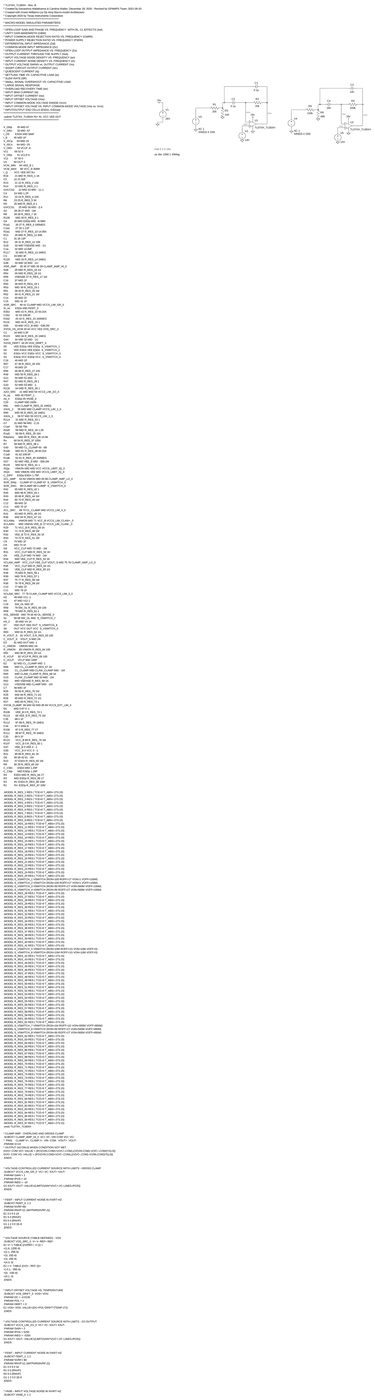
[diagram p0: schematic bandpass.asc, whole sheet]
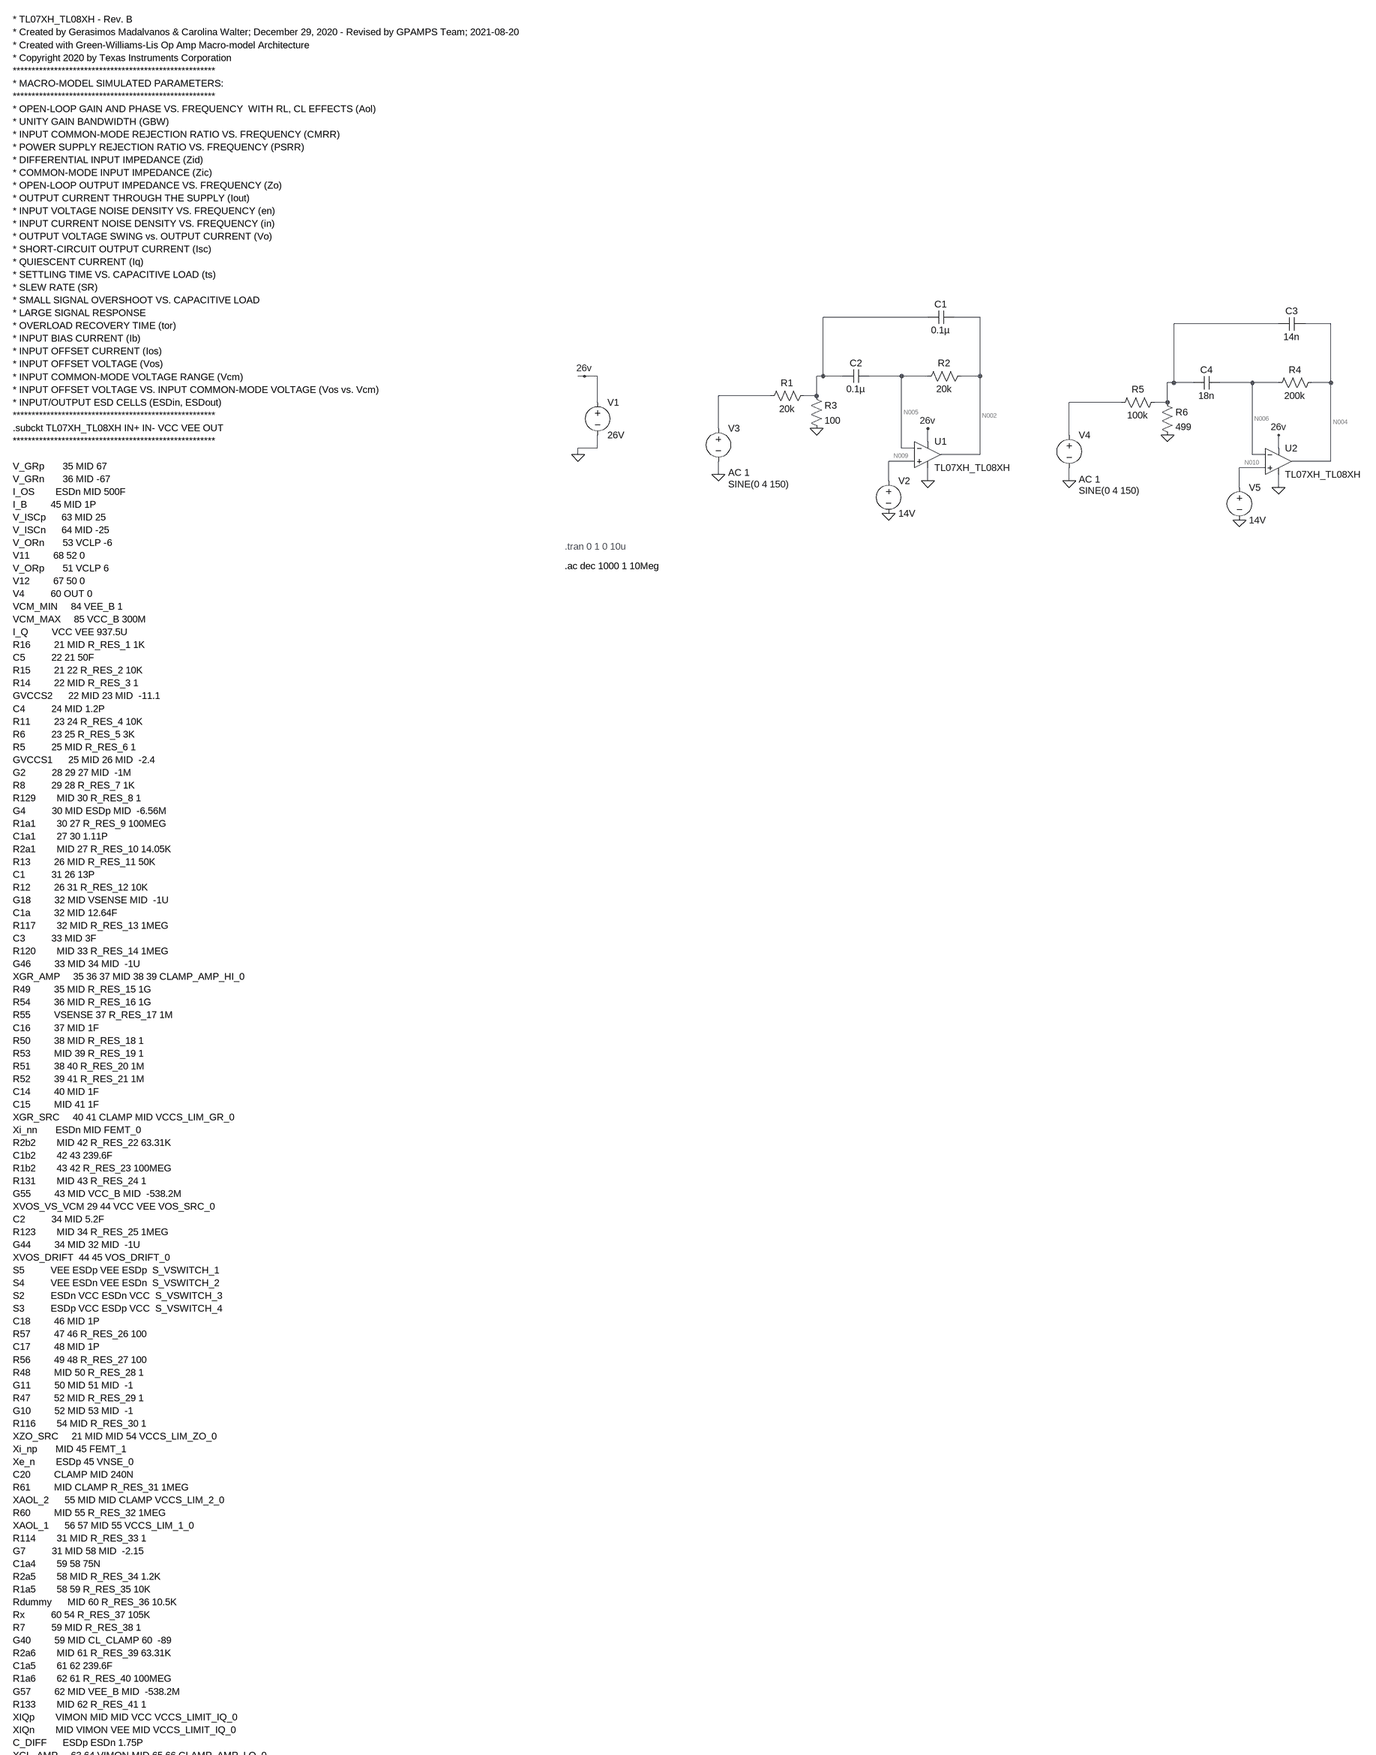
[diagram p1: schematic bandpass.asc, part, row 1 of 3, column 1 of 1]
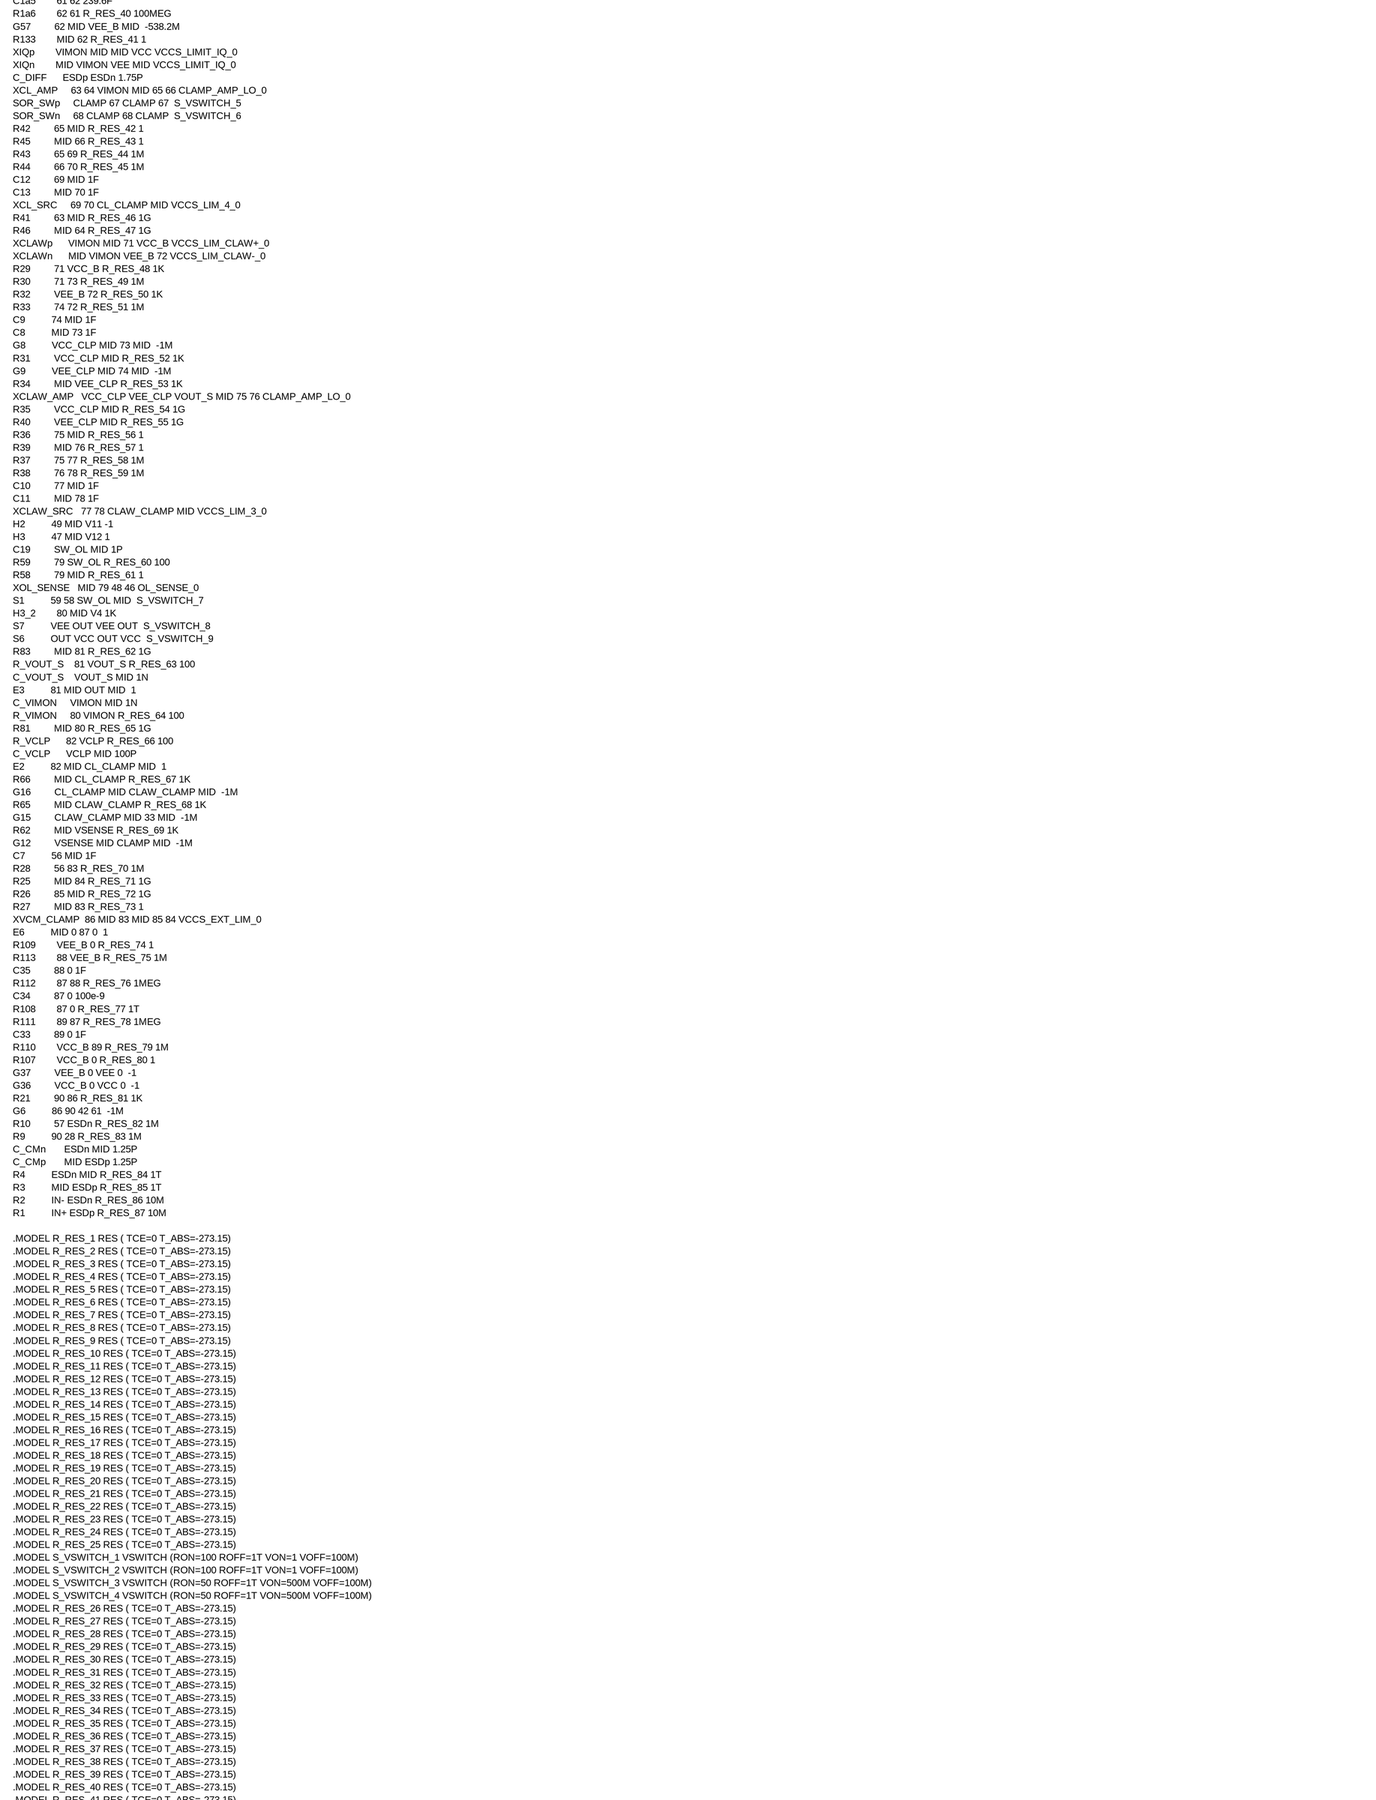
[diagram p2: schematic bandpass.asc, part, row 2 of 3, column 1 of 1]
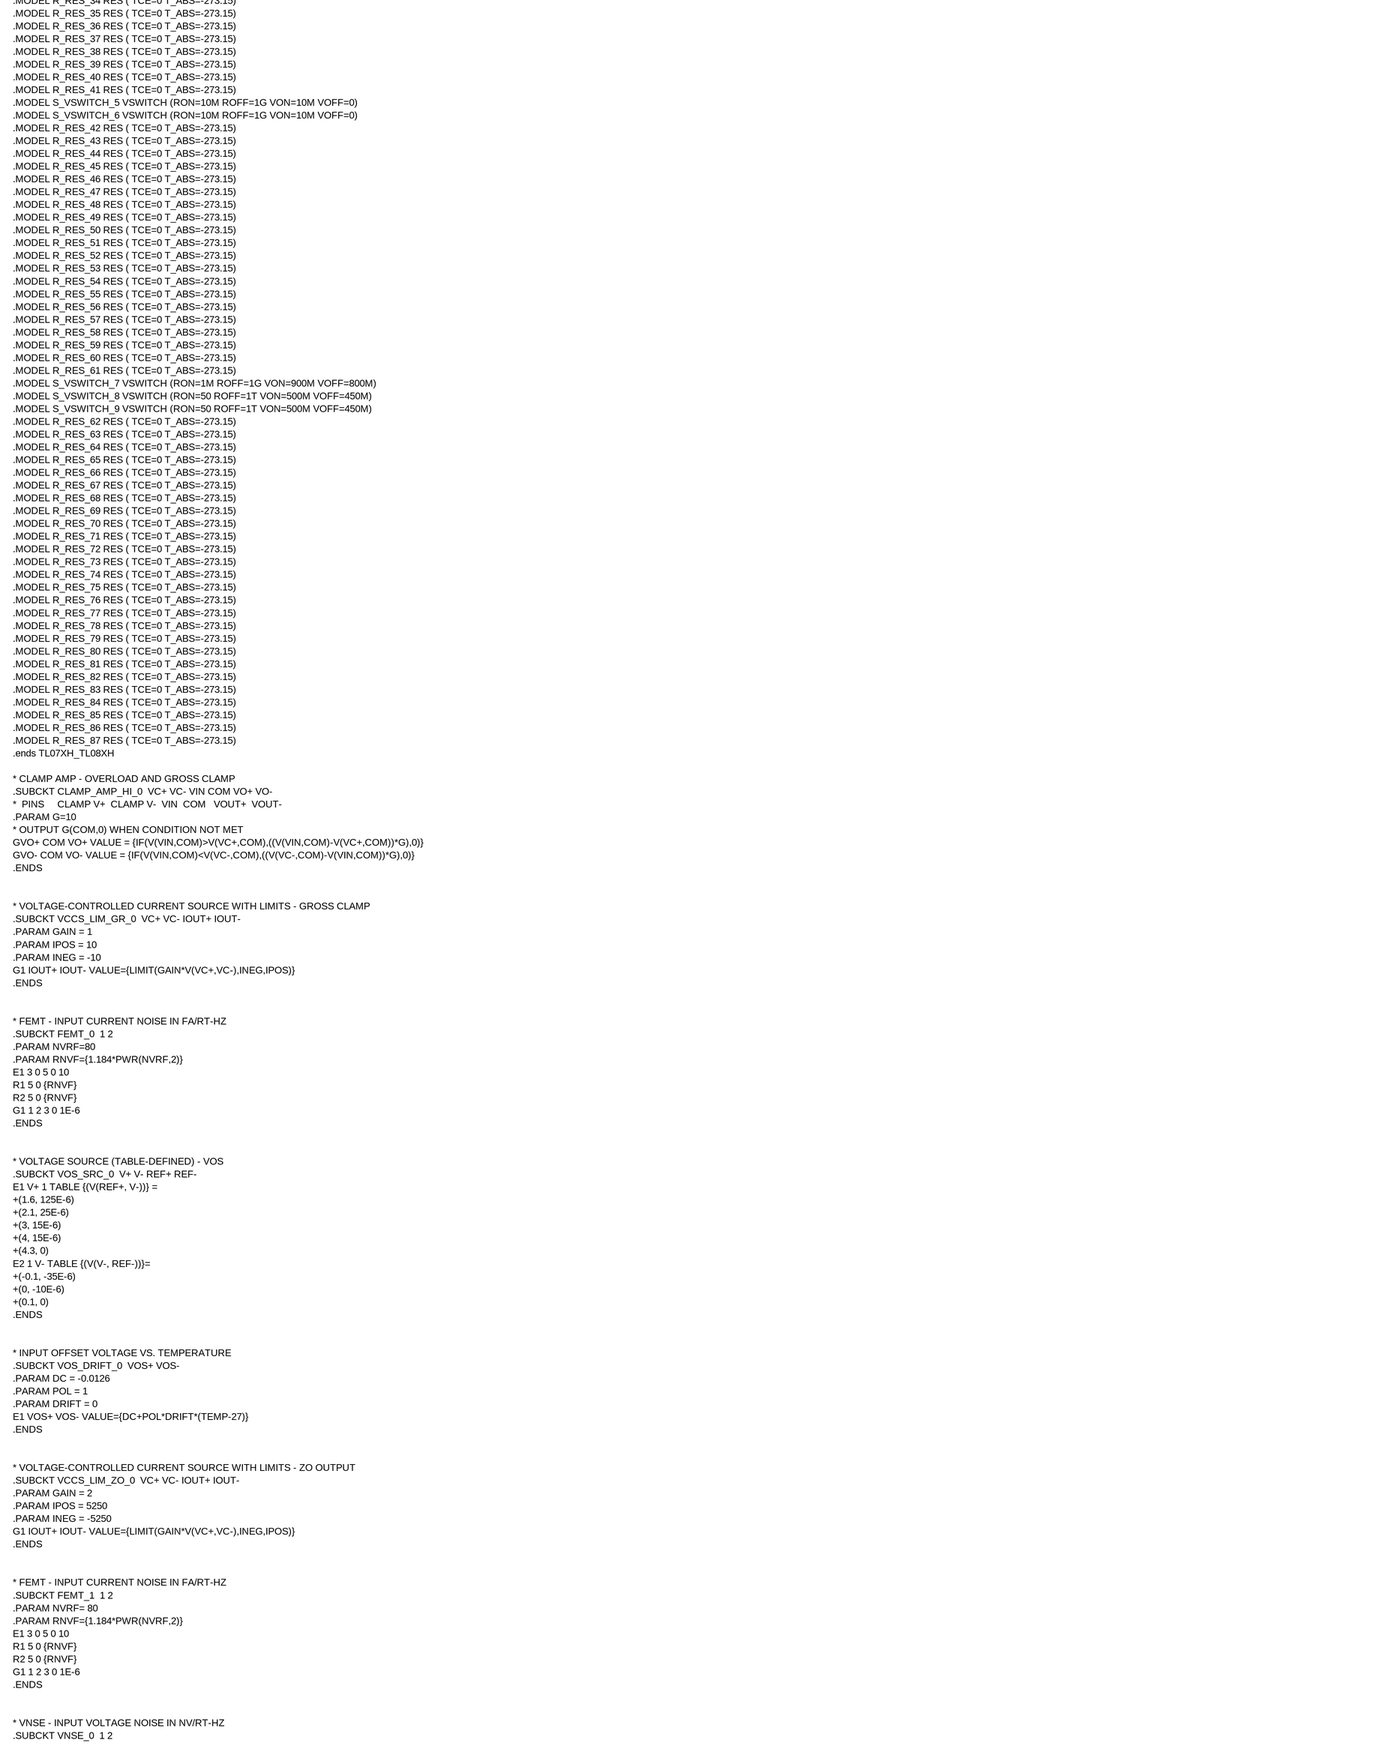
[diagram p3: schematic bandpass.asc, part, row 3 of 3, column 1 of 1]
bandpass.asc, the LTspice schematic file:
Version 4
SHEET 1 1752 12944
WIRE 640 -288 384 -288
WIRE 768 -288 704 -288
WIRE 1536 -272 1280 -272
WIRE 1664 -272 1600 -272
WIRE -720 -144 -736 -144
WIRE -688 -144 -720 -144
WIRE 384 -144 384 -288
WIRE 384 -144 368 -144
WIRE 432 -144 384 -144
WIRE 576 -144 496 -144
WIRE 640 -144 576 -144
WIRE 768 -144 768 -288
WIRE 768 -144 720 -144
WIRE 1280 -128 1280 -272
WIRE 1280 -128 1264 -128
WIRE 1328 -128 1280 -128
WIRE 1472 -128 1392 -128
WIRE 1536 -128 1472 -128
WIRE 1664 -128 1664 -272
WIRE 1664 -128 1616 -128
WIRE 256 -96 128 -96
WIRE 368 -96 368 -144
WIRE 368 -96 336 -96
WIRE -688 -80 -688 -144
WIRE 1152 -80 1024 -80
WIRE 1264 -80 1264 -128
WIRE 1264 -80 1232 -80
WIRE 128 -16 128 -96
WIRE 1024 0 1024 -80
WIRE 640 16 640 -16
WIRE -688 32 -688 0
WIRE -688 32 -736 32
WIRE 576 32 576 -144
WIRE 608 32 576 32
WIRE 1536 32 1536 0
WIRE -736 48 -736 32
WIRE 768 48 768 -144
WIRE 768 48 672 48
WIRE 1472 48 1472 -128
WIRE 1504 48 1472 48
WIRE 608 64 544 64
WIRE 1664 64 1664 -128
WIRE 1664 64 1568 64
WIRE 1504 80 1440 80
WIRE 128 96 128 64
WIRE 544 112 544 64
WIRE 640 112 640 80
WIRE 1024 112 1024 80
WIRE 1440 128 1440 80
WIRE 1536 128 1536 96
FLAG -736 48 0
FLAG -720 -144 26v
FLAG 640 -16 26v
FLAG 128 96 0
FLAG 368 -16 0
FLAG 640 112 0
FLAG 544 192 0
FLAG 1536 0 26v
FLAG 1024 112 0
FLAG 1264 0 0
FLAG 1536 128 0
FLAG 1440 208 0
SYMBOL voltage -688 -96 R0
WINDOW 123 0 0 Left 0
WINDOW 39 0 0 Left 0
SYMATTR InstName V1
SYMATTR Value 26V
SYMBOL voltage 128 -32 R0
WINDOW 3 24 152 Left 2
WINDOW 123 24 124 Left 2
WINDOW 39 0 0 Left 0
SYMATTR Value SINE(0 4 150)
SYMATTR Value2 AC 1
SYMATTR InstName V3
SYMBOL res 736 -160 R90
WINDOW 0 0 56 VBottom 2
WINDOW 3 32 56 VTop 2
SYMATTR InstName R2
SYMATTR Value 20k
SYMBOL res 352 -112 R90
WINDOW 0 0 56 VBottom 2
WINDOW 3 32 56 VTop 2
SYMATTR InstName R1
SYMATTR Value 20k
SYMBOL res 352 -112 R0
SYMATTR InstName R3
SYMATTR Value 100
SYMBOL OpAmps\\opamp2 640 -16 R0
SYMATTR InstName U1
SYMATTR Value TL07XH_TL08XH
SYMBOL voltage 544 96 R0
WINDOW 123 0 0 Left 0
WINDOW 39 0 0 Left 0
SYMATTR InstName V2
SYMATTR Value 14V
SYMBOL cap 704 -304 R90
WINDOW 0 0 32 VBottom 2
WINDOW 3 32 32 VTop 2
SYMATTR InstName C1
SYMATTR Value 0.1µ
SYMBOL cap 496 -160 R90
WINDOW 0 0 32 VBottom 2
WINDOW 3 32 32 VTop 2
SYMATTR InstName C2
SYMATTR Value 0.1µ
SYMBOL voltage 1024 -16 R0
WINDOW 3 24 152 Left 2
WINDOW 123 24 124 Left 2
WINDOW 39 0 0 Left 0
SYMATTR Value SINE(0 4 150)
SYMATTR Value2 AC 1
SYMATTR InstName V4
SYMBOL res 1632 -144 R90
WINDOW 0 0 56 VBottom 2
WINDOW 3 32 56 VTop 2
SYMATTR InstName R4
SYMATTR Value 200k
SYMBOL res 1248 -96 R90
WINDOW 0 0 56 VBottom 2
WINDOW 3 32 56 VTop 2
SYMATTR InstName R5
SYMATTR Value 100k
SYMBOL res 1248 -96 R0
SYMATTR InstName R6
SYMATTR Value 499
SYMBOL OpAmps\\opamp2 1536 0 R0
SYMATTR InstName U2
SYMATTR Value TL07XH_TL08XH
SYMBOL voltage 1440 112 R0
WINDOW 123 0 0 Left 0
WINDOW 39 0 0 Left 0
SYMATTR InstName V5
SYMATTR Value 14V
SYMBOL cap 1600 -288 R90
WINDOW 0 0 32 VBottom 2
WINDOW 3 32 32 VTop 2
SYMATTR InstName C3
SYMATTR Value 14n
SYMBOL cap 1392 -144 R90
WINDOW 0 0 32 VBottom 2
WINDOW 3 32 32 VTop 2
SYMATTR InstName C4
SYMATTR Value 18n
TEXT -768 272 Left 2 ;.tran 0 1 0 10u
TEXT -768 320 Left 2 !.ac dec 1000 1 10Meg
TEXT -2480 -1016 Left 2 !* TL07XH_TL08XH - Rev. B\n* Created by Gerasimos Madalvanos & Carolina Walter; December 29, 2020 - Revised by GPAMPS Team; 2021-08-20\n* Created with Green-Williams-Lis Op Amp Macro-model Architecture\n* Copyright 2020 by Texas Instruments Corporation\n******************************************************\n* MACRO-MODEL SIMULATED PARAMETERS:\n******************************************************\n* OPEN-LOOP GAIN AND PHASE VS. FREQUENCY  WITH RL, CL EFFECTS (Aol)\n* UNITY GAIN BANDWIDTH (GBW)\n* INPUT COMMON-MODE REJECTION RATIO VS. FREQUENCY (CMRR)\n* POWER SUPPLY REJECTION RATIO VS. FREQUENCY (PSRR)\n* DIFFERENTIAL INPUT IMPEDANCE (Zid)\n* COMMON-MODE INPUT IMPEDANCE (Zic)\n* OPEN-LOOP OUTPUT IMPEDANCE VS. FREQUENCY (Zo)\n* OUTPUT CURRENT THROUGH THE SUPPLY (Iout)\n* INPUT VOLTAGE NOISE DENSITY VS. FREQUENCY (en)\n* INPUT CURRENT NOISE DENSITY VS. FREQUENCY (in)\n* OUTPUT VOLTAGE SWING vs. OUTPUT CURRENT (Vo)\n* SHORT-CIRCUIT OUTPUT CURRENT (Isc)\n* QUIESCENT CURRENT (Iq)\n* SETTLING TIME VS. CAPACITIVE LOAD (ts)\n* SLEW RATE (SR)\n* SMALL SIGNAL OVERSHOOT VS. CAPACITIVE LOAD\n* LARGE SIGNAL RESPONSE\n* OVERLOAD RECOVERY TIME (tor)\n* INPUT BIAS CURRENT (Ib)\n* INPUT OFFSET CURRENT (Ios)\n* INPUT OFFSET VOLTAGE (Vos)\n* INPUT COMMON-MODE VOLTAGE RANGE (Vcm)\n* INPUT OFFSET VOLTAGE VS. INPUT COMMON-MODE VOLTAGE (Vos vs. Vcm)\n* INPUT/OUTPUT ESD CELLS (ESDin, ESDout)\n******************************************************\n.subckt TL07XH_TL08XH IN+ IN- VCC VEE OUT\n******************************************************\n \nV_GRp       35 MID 67\nV_GRn       36 MID -67\nI_OS        ESDn MID 500F\nI_B         45 MID 1P\nV_ISCp      63 MID 25\nV_ISCn      64 MID -25\nV_ORn       53 VCLP -6\nV11         68 52 0\nV_ORp       51 VCLP 6\nV12         67 50 0\nV4          60 OUT 0\nVCM_MIN     84 VEE_B 1\nVCM_MAX     85 VCC_B 300M\nI_Q         VCC VEE 937.5U\nR16         21 MID R_RES_1 1K \nC5          22 21 50F \nR15         21 22 R_RES_2 10K \nR14         22 MID R_RES_3 1 \nGVCCS2      22 MID 23 MID  -11.1\nC4          24 MID 1.2P \nR11         23 24 R_RES_4 10K \nR6          23 25 R_RES_5 3K \nR5          25 MID R_RES_6 1 \nGVCCS1      25 MID 26 MID  -2.4\nG2          28 29 27 MID  -1M\nR8          29 28 R_RES_7 1K \nR129        MID 30 R_RES_8 1 \nG4          30 MID ESDp MID  -6.56M\nR1a1        30 27 R_RES_9 100MEG \nC1a1        27 30 1.11P \nR2a1        MID 27 R_RES_10 14.05K \nR13         26 MID R_RES_11 50K \nC1          31 26 13P \nR12         26 31 R_RES_12 10K \nG18         32 MID VSENSE MID  -1U\nC1a         32 MID 12.64F \nR117        32 MID R_RES_13 1MEG \nC3          33 MID 3F \nR120        MID 33 R_RES_14 1MEG \nG46         33 MID 34 MID  -1U\nXGR_AMP     35 36 37 MID 38 39 CLAMP_AMP_HI_0\nR49         35 MID R_RES_15 1G \nR54         36 MID R_RES_16 1G \nR55         VSENSE 37 R_RES_17 1M \nC16         37 MID 1F \nR50         38 MID R_RES_18 1 \nR53         MID 39 R_RES_19 1 \nR51         38 40 R_RES_20 1M \nR52         39 41 R_RES_21 1M \nC14         40 MID 1F \nC15         MID 41 1F \nXGR_SRC     40 41 CLAMP MID VCCS_LIM_GR_0\nXi_nn       ESDn MID FEMT_0\nR2b2        MID 42 R_RES_22 63.31K \nC1b2        42 43 239.6F \nR1b2        43 42 R_RES_23 100MEG \nR131        MID 43 R_RES_24 1 \nG55         43 MID VCC_B MID  -538.2M\nXVOS_VS_VCM 29 44 VCC VEE VOS_SRC_0\nC2          34 MID 5.2F \nR123        MID 34 R_RES_25 1MEG \nG44         34 MID 32 MID  -1U\nXVOS_DRIFT  44 45 VOS_DRIFT_0\nS5          VEE ESDp VEE ESDp  S_VSWITCH_1\nS4          VEE ESDn VEE ESDn  S_VSWITCH_2\nS2          ESDn VCC ESDn VCC  S_VSWITCH_3\nS3          ESDp VCC ESDp VCC  S_VSWITCH_4\nC18         46 MID 1P \nR57         47 46 R_RES_26 100 \nC17         48 MID 1P \nR56         49 48 R_RES_27 100 \nR48         MID 50 R_RES_28 1 \nG11         50 MID 51 MID  -1\nR47         52 MID R_RES_29 1 \nG10         52 MID 53 MID  -1\nR116        54 MID R_RES_30 1 \nXZO_SRC     21 MID MID 54 VCCS_LIM_ZO_0\nXi_np       MID 45 FEMT_1\nXe_n        ESDp 45 VNSE_0\nC20         CLAMP MID 240N \nR61         MID CLAMP R_RES_31 1MEG \nXAOL_2      55 MID MID CLAMP VCCS_LIM_2_0\nR60         MID 55 R_RES_32 1MEG \nXAOL_1      56 57 MID 55 VCCS_LIM_1_0\nR114        31 MID R_RES_33 1 \nG7          31 MID 58 MID  -2.15\nC1a4        59 58 75N \nR2a5        58 MID R_RES_34 1.2K \nR1a5        58 59 R_RES_35 10K \nRdummy      MID 60 R_RES_36 10.5K \nRx          60 54 R_RES_37 105K \nR7          59 MID R_RES_38 1 \nG40         59 MID CL_CLAMP 60  -89\nR2a6        MID 61 R_RES_39 63.31K \nC1a5        61 62 239.6F \nR1a6        62 61 R_RES_40 100MEG \nG57         62 MID VEE_B MID  -538.2M\nR133        MID 62 R_RES_41 1 \nXIQp        VIMON MID MID VCC VCCS_LIMIT_IQ_0\nXIQn        MID VIMON VEE MID VCCS_LIMIT_IQ_0\nC_DIFF      ESDp ESDn 1.75P \nXCL_AMP     63 64 VIMON MID 65 66 CLAMP_AMP_LO_0\nSOR_SWp     CLAMP 67 CLAMP 67  S_VSWITCH_5\nSOR_SWn     68 CLAMP 68 CLAMP  S_VSWITCH_6\nR42         65 MID R_RES_42 1 \nR45         MID 66 R_RES_43 1 \nR43         65 69 R_RES_44 1M \nR44         66 70 R_RES_45 1M \nC12         69 MID 1F \nC13         MID 70 1F \nXCL_SRC     69 70 CL_CLAMP MID VCCS_LIM_4_0\nR41         63 MID R_RES_46 1G \nR46         MID 64 R_RES_47 1G \nXCLAWp      VIMON MID 71 VCC_B VCCS_LIM_CLAW+_0\nXCLAWn      MID VIMON VEE_B 72 VCCS_LIM_CLAW-_0\nR29         71 VCC_B R_RES_48 1K \nR30         71 73 R_RES_49 1M \nR32         VEE_B 72 R_RES_50 1K \nR33         74 72 R_RES_51 1M \nC9          74 MID 1F \nC8          MID 73 1F \nG8          VCC_CLP MID 73 MID  -1M\nR31         VCC_CLP MID R_RES_52 1K \nG9          VEE_CLP MID 74 MID  -1M\nR34         MID VEE_CLP R_RES_53 1K \nXCLAW_AMP   VCC_CLP VEE_CLP VOUT_S MID 75 76 CLAMP_AMP_LO_0\nR35         VCC_CLP MID R_RES_54 1G \nR40         VEE_CLP MID R_RES_55 1G \nR36         75 MID R_RES_56 1 \nR39         MID 76 R_RES_57 1 \nR37         75 77 R_RES_58 1M \nR38         76 78 R_RES_59 1M \nC10         77 MID 1F \nC11         MID 78 1F \nXCLAW_SRC   77 78 CLAW_CLAMP MID VCCS_LIM_3_0\nH2          49 MID V11 -1\nH3          47 MID V12 1\nC19         SW_OL MID 1P \nR59         79 SW_OL R_RES_60 100 \nR58         79 MID R_RES_61 1 \nXOL_SENSE   MID 79 48 46 OL_SENSE_0\nS1          59 58 SW_OL MID  S_VSWITCH_7\nH3_2        80 MID V4 1K\nS7          VEE OUT VEE OUT  S_VSWITCH_8\nS6          OUT VCC OUT VCC  S_VSWITCH_9\nR83         MID 81 R_RES_62 1G \nR_VOUT_S    81 VOUT_S R_RES_63 100 \nC_VOUT_S    VOUT_S MID 1N \nE3          81 MID OUT MID  1\nC_VIMON     VIMON MID 1N \nR_VIMON     80 VIMON R_RES_64 100 \nR81         MID 80 R_RES_65 1G \nR_VCLP      82 VCLP R_RES_66 100 \nC_VCLP      VCLP MID 100P \nE2          82 MID CL_CLAMP MID  1\nR66         MID CL_CLAMP R_RES_67 1K \nG16         CL_CLAMP MID CLAW_CLAMP MID  -1M\nR65         MID CLAW_CLAMP R_RES_68 1K \nG15         CLAW_CLAMP MID 33 MID  -1M\nR62         MID VSENSE R_RES_69 1K \nG12         VSENSE MID CLAMP MID  -1M\nC7          56 MID 1F \nR28         56 83 R_RES_70 1M \nR25         MID 84 R_RES_71 1G \nR26         85 MID R_RES_72 1G \nR27         MID 83 R_RES_73 1 \nXVCM_CLAMP  86 MID 83 MID 85 84 VCCS_EXT_LIM_0\nE6          MID 0 87 0  1\nR109        VEE_B 0 R_RES_74 1 \nR113        88 VEE_B R_RES_75 1M \nC35         88 0 1F \nR112        87 88 R_RES_76 1MEG \nC34         87 0 100e-9 \nR108        87 0 R_RES_77 1T \nR111        89 87 R_RES_78 1MEG \nC33         89 0 1F \nR110        VCC_B 89 R_RES_79 1M \nR107        VCC_B 0 R_RES_80 1 \nG37         VEE_B 0 VEE 0  -1\nG36         VCC_B 0 VCC 0  -1\nR21         90 86 R_RES_81 1K \nG6          86 90 42 61  -1M\nR10         57 ESDn R_RES_82 1M \nR9          90 28 R_RES_83 1M \nC_CMn       ESDn MID 1.25P \nC_CMp       MID ESDp 1.25P \nR4          ESDn MID R_RES_84 1T \nR3          MID ESDp R_RES_85 1T \nR2          IN- ESDn R_RES_86 10M \nR1          IN+ ESDp R_RES_87 10M \n \n.MODEL R_RES_1 RES ( TCE=0 T_ABS=-273.15)\n.MODEL R_RES_2 RES ( TCE=0 T_ABS=-273.15)\n.MODEL R_RES_3 RES ( TCE=0 T_ABS=-273.15)\n.MODEL R_RES_4 RES ( TCE=0 T_ABS=-273.15)\n.MODEL R_RES_5 RES ( TCE=0 T_ABS=-273.15)\n.MODEL R_RES_6 RES ( TCE=0 T_ABS=-273.15)\n.MODEL R_RES_7 RES ( TCE=0 T_ABS=-273.15)\n.MODEL R_RES_8 RES ( TCE=0 T_ABS=-273.15)\n.MODEL R_RES_9 RES ( TCE=0 T_ABS=-273.15)\n.MODEL R_RES_10 RES ( TCE=0 T_ABS=-273.15)\n.MODEL R_RES_11 RES ( TCE=0 T_ABS=-273.15)\n.MODEL R_RES_12 RES ( TCE=0 T_ABS=-273.15)\n.MODEL R_RES_13 RES ( TCE=0 T_ABS=-273.15)\n.MODEL R_RES_14 RES ( TCE=0 T_ABS=-273.15)\n.MODEL R_RES_15 RES ( TCE=0 T_ABS=-273.15)\n.MODEL R_RES_16 RES ( TCE=0 T_ABS=-273.15)\n.MODEL R_RES_17 RES ( TCE=0 T_ABS=-273.15)\n.MODEL R_RES_18 RES ( TCE=0 T_ABS=-273.15)\n.MODEL R_RES_19 RES ( TCE=0 T_ABS=-273.15)\n.MODEL R_RES_20 RES ( TCE=0 T_ABS=-273.15)\n.MODEL R_RES_21 RES ( TCE=0 T_ABS=-273.15)\n.MODEL R_RES_22 RES ( TCE=0 T_ABS=-273.15)\n.MODEL R_RES_23 RES ( TCE=0 T_ABS=-273.15)\n.MODEL R_RES_24 RES ( TCE=0 T_ABS=-273.15)\n.MODEL R_RES_25 RES ( TCE=0 T_ABS=-273.15)\n.MODEL S_VSWITCH_1 VSWITCH (RON=100 ROFF=1T VON=1 VOFF=100M)\n.MODEL S_VSWITCH_2 VSWITCH (RON=100 ROFF=1T VON=1 VOFF=100M)\n.MODEL S_VSWITCH_3 VSWITCH (RON=50 ROFF=1T VON=500M VOFF=100M)\n.MODEL S_VSWITCH_4 VSWITCH (RON=50 ROFF=1T VON=500M VOFF=100M)\n.MODEL R_RES_26 RES ( TCE=0 T_ABS=-273.15)\n.MODEL R_RES_27 RES ( TCE=0 T_ABS=-273.15)\n.MODEL R_RES_28 RES ( TCE=0 T_ABS=-273.15)\n.MODEL R_RES_29 RES ( TCE=0 T_ABS=-273.15)\n.MODEL R_RES_30 RES ( TCE=0 T_ABS=-273.15)\n.MODEL R_RES_31 RES ( TCE=0 T_ABS=-273.15)\n.MODEL R_RES_32 RES ( TCE=0 T_ABS=-273.15)\n.MODEL R_RES_33 RES ( TCE=0 T_ABS=-273.15)\n.MODEL R_RES_34 RES ( TCE=0 T_ABS=-273.15)\n.MODEL R_RES_35 RES ( TCE=0 T_ABS=-273.15)\n.MODEL R_RES_36 RES ( TCE=0 T_ABS=-273.15)\n.MODEL R_RES_37 RES ( TCE=0 T_ABS=-273.15)\n.MODEL R_RES_38 RES ( TCE=0 T_ABS=-273.15)\n.MODEL R_RES_39 RES ( TCE=0 T_ABS=-273.15)\n.MODEL R_RES_40 RES ( TCE=0 T_ABS=-273.15)\n.MODEL R_RES_41 RES ( TCE=0 T_ABS=-273.15)\n.MODEL S_VSWITCH_5 VSWITCH (RON=10M ROFF=1G VON=10M VOFF=0)\n.MODEL S_VSWITCH_6 VSWITCH (RON=10M ROFF=1G VON=10M VOFF=0)\n.MODEL R_RES_42 RES ( TCE=0 T_ABS=-273.15)\n.MODEL R_RES_43 RES ( TCE=0 T_ABS=-273.15)\n.MODEL R_RES_44 RES ( TCE=0 T_ABS=-273.15)\n.MODEL R_RES_45 RES ( TCE=0 T_ABS=-273.15)\n.MODEL R_RES_46 RES ( TCE=0 T_ABS=-273.15)\n.MODEL R_RES_47 RES ( TCE=0 T_ABS=-273.15)\n.MODEL R_RES_48 RES ( TCE=0 T_ABS=-273.15)\n.MODEL R_RES_49 RES ( TCE=0 T_ABS=-273.15)\n.MODEL R_RES_50 RES ( TCE=0 T_ABS=-273.15)\n.MODEL R_RES_51 RES ( TCE=0 T_ABS=-273.15)\n.MODEL R_RES_52 RES ( TCE=0 T_ABS=-273.15)\n.MODEL R_RES_53 RES ( TCE=0 T_ABS=-273.15)\n.MODEL R_RES_54 RES ( TCE=0 T_ABS=-273.15)\n.MODEL R_RES_55 RES ( TCE=0 T_ABS=-273.15)\n.MODEL R_RES_56 RES ( TCE=0 T_ABS=-273.15)\n.MODEL R_RES_57 RES ( TCE=0 T_ABS=-273.15)\n.MODEL R_RES_58 RES ( TCE=0 T_ABS=-273.15)\n.MODEL R_RES_59 RES ( TCE=0 T_ABS=-273.15)\n.MODEL R_RES_60 RES ( TCE=0 T_ABS=-273.15)\n.MODEL R_RES_61 RES ( TCE=0 T_ABS=-273.15)\n.MODEL S_VSWITCH_7 VSWITCH (RON=1M ROFF=1G VON=900M VOFF=800M)\n.MODEL S_VSWITCH_8 VSWITCH (RON=50 ROFF=1T VON=500M VOFF=450M)\n.MODEL S_VSWITCH_9 VSWITCH (RON=50 ROFF=1T VON=500M VOFF=450M)\n.MODEL R_RES_62 RES ( TCE=0 T_ABS=-273.15)\n.MODEL R_RES_63 RES ( TCE=0 T_ABS=-273.15)\n.MODEL R_RES_64 RES ( TCE=0 T_ABS=-273.15)\n.MODEL R_RES_65 RES ( TCE=0 T_ABS=-273.15)\n.MODEL R_RES_66 RES ( TCE=0 T_ABS=-273.15)\n.MODEL R_RES_67 RES ( TCE=0 T_ABS=-273.15)\n.MODEL R_RES_68 RES ( TCE=0 T_ABS=-273.15)\n.MODEL R_RES_69 RES ( TCE=0 T_ABS=-273.15)\n.MODEL R_RES_70 RES ( TCE=0 T_ABS=-273.15)\n.MODEL R_RES_71 RES ( TCE=0 T_ABS=-273.15)\n.MODEL R_RES_72 RES ( TCE=0 T_ABS=-273.15)\n.MODEL R_RES_73 RES ( TCE=0 T_ABS=-273.15)\n.MODEL R_RES_74 RES ( TCE=0 T_ABS=-273.15)\n.MODEL R_RES_75 RES ( TCE=0 T_ABS=-273.15)\n.MODEL R_RES_76 RES ( TCE=0 T_ABS=-273.15)\n.MODEL R_RES_77 RES ( TCE=0 T_ABS=-273.15)\n.MODEL R_RES_78 RES ( TCE=0 T_ABS=-273.15)\n.MODEL R_RES_79 RES ( TCE=0 T_ABS=-273.15)\n.MODEL R_RES_80 RES ( TCE=0 T_ABS=-273.15)\n.MODEL R_RES_81 RES ( TCE=0 T_ABS=-273.15)\n.MODEL R_RES_82 RES ( TCE=0 T_ABS=-273.15)\n.MODEL R_RES_83 RES ( TCE=0 T_ABS=-273.15)\n.MODEL R_RES_84 RES ( TCE=0 T_ABS=-273.15)\n.MODEL R_RES_85 RES ( TCE=0 T_ABS=-273.15)\n.MODEL R_RES_86 RES ( TCE=0 T_ABS=-273.15)\n.MODEL R_RES_87 RES ( TCE=0 T_ABS=-273.15)\n.ends TL07XH_TL08XH\n \n* CLAMP AMP - OVERLOAD AND GROSS CLAMP\n.SUBCKT CLAMP_AMP_HI_0  VC+ VC- VIN COM VO+ VO-\n*  PINS     CLAMP V+  CLAMP V-  VIN  COM   VOUT+  VOUT-\n.PARAM G=10\n* OUTPUT G(COM,0) WHEN CONDITION NOT MET\nGVO+ COM VO+ VALUE = {IF(V(VIN,COM)>V(VC+,COM),((V(VIN,COM)-V(VC+,COM))*G),0)}\nGVO- COM VO- VALUE = {IF(V(VIN,COM)<V(VC-,COM),((V(VC-,COM)-V(VIN,COM))*G),0)}\n.ENDS\n \n\n* VOLTAGE-CONTROLLED CURRENT SOURCE WITH LIMITS - GROSS CLAMP\n.SUBCKT VCCS_LIM_GR_0  VC+ VC- IOUT+ IOUT-\n.PARAM GAIN = 1\n.PARAM IPOS = 10\n.PARAM INEG = -10\nG1 IOUT+ IOUT- VALUE={LIMIT(GAIN*V(VC+,VC-),INEG,IPOS)}\n.ENDS\n \n\n* FEMT - INPUT CURRENT NOISE IN FA/RT-HZ\n.SUBCKT FEMT_0  1 2\n.PARAM NVRF=80\n.PARAM RNVF={1.184*PWR(NVRF,2)}\nE1 3 0 5 0 10\nR1 5 0 {RNVF}\nR2 5 0 {RNVF}\nG1 1 2 3 0 1E-6\n.ENDS\n \n\n* VOLTAGE SOURCE (TABLE-DEFINED) - VOS\n.SUBCKT VOS_SRC_0  V+ V- REF+ REF-\nE1 V+ 1 TABLE {(V(REF+, V-))} =\n+(1.6, 125E-6)\n+(2.1, 25E-6)\n+(3, 15E-6)\n+(4, 15E-6)\n+(4.3, 0)\nE2 1 V- TABLE {(V(V-, REF-))}=\n+(-0.1, -35E-6)\n+(0, -10E-6)\n+(0.1, 0)\n.ENDS\n \n\n* INPUT OFFSET VOLTAGE VS. TEMPERATURE\n.SUBCKT VOS_DRIFT_0  VOS+ VOS-\n.PARAM DC = -0.0126\n.PARAM POL = 1\n.PARAM DRIFT = 0\nE1 VOS+ VOS- VALUE={DC+POL*DRIFT*(TEMP-27)}\n.ENDS\n \n\n* VOLTAGE-CONTROLLED CURRENT SOURCE WITH LIMITS - ZO OUTPUT\n.SUBCKT VCCS_LIM_ZO_0  VC+ VC- IOUT+ IOUT-\n.PARAM GAIN = 2\n.PARAM IPOS = 5250\n.PARAM INEG = -5250\nG1 IOUT+ IOUT- VALUE={LIMIT(GAIN*V(VC+,VC-),INEG,IPOS)}\n.ENDS\n \n\n* FEMT - INPUT CURRENT NOISE IN FA/RT-HZ\n.SUBCKT FEMT_1  1 2\n.PARAM NVRF= 80\n.PARAM RNVF={1.184*PWR(NVRF,2)}\nE1 3 0 5 0 10\nR1 5 0 {RNVF}\nR2 5 0 {RNVF}\nG1 1 2 3 0 1E-6\n.ENDS\n \n\n* VNSE - INPUT VOLTAGE NOISE IN NV/RT-HZ\n.SUBCKT VNSE_0  1 2\n.PARAM FLW=1\n.PARAM NLF=1.02E3\n.PARAM NVR=1.98E1\n.PARAM GLF={PWR(FLW,0.25)*NLF/1164}\n.PARAM RNV={1.184*PWR(NVR,2)}\n.MODEL DVN D KF={PWR(FLW,0.5)/1E11} IS=1.0E-16\nI1 0 7 10E-3\nI2 0 8 10E-3\nD1 7 0 DVN\nD2 8 0 DVN\nE1 3 6 7 8 {GLF}\nR1 3 0 1E9\nR2 3 0 1E9\nR3 3 6 1E9\nE2 6 4 5 0 10\nR4 5 0 {RNV}\nR5 5 0 {RNV}\nR6 3 4 1E9\nR7 4 0 1E9\nE3 1 2 3 4 1\n.ENDS\n \n\n* VOLTAGE-CONTROLLED CURRENT SOURCE WITH LIMITS - AOL SECOND STAGE\n.SUBCKT VCCS_LIM_2_0  VC+ VC- IOUT+ IOUT-\n.PARAM GAIN = 11.3E-2\n.PARAM IPOS = 4.8\n.PARAM INEG = -4.8\nG1 IOUT+ IOUT- VALUE={LIMIT(GAIN*V(VC+,VC-),INEG,IPOS)}\n.ENDS\n \n\n* VOLTAGE-CONTROLLED CURRENT SOURCE WITH LIMITS - AOL FIRST STAGE\n.SUBCKT VCCS_LIM_1_0  VC+ VC- IOUT+ IOUT-\n.PARAM GAIN = 1E-4\n.PARAM IPOS = .5\n.PARAM INEG = -.5\nG1 IOUT+ IOUT- VALUE={LIMIT(GAIN*V(VC+,VC-),INEG,IPOS)}\n.ENDS\n \n\n* VOLTAGE-CONTROLLED SOURCE WITH LIMITS - IOUT DRAW\n.SUBCKT VCCS_LIMIT_IQ_0  VC+ VC- IOUT+ IOUT-\n.PARAM GAIN = 1E-3\nG1 IOUT- IOUT+ VALUE={IF( (V(VC+,VC-)<=0),0,GAIN*V(VC+,VC-) )}\n.ENDS\n \n\n* CLAMP AMP - CLAW AND CURRENT LIMIT CLAMP\n.SUBCKT CLAMP_AMP_LO_0  VC+ VC- VIN COM VO+ VO-\n*  PINS     CLAMP V+  CLAMP V-  VIN  COM   VOUT+  VOUT-\n.PARAM G=1\n* OUTPUT G(COM,0) WHEN CONDITION NOT MET\nGVO+ COM VO+ VALUE = {IF(V(VIN,COM)>V(VC+,COM),((V(VIN,COM)-V(VC+,COM))*G),0)}\nGVO- COM VO- VALUE = {IF(V(VIN,COM)<V(VC-,COM),((V(VC-,COM)-V(VIN,COM))*G),0)}\n.ENDS\n \n\n* VOLTAGE-CONTROLLED CURRENT SOURCE WITH LIMITS - CURRENT LIMIT CLAMP\n.SUBCKT VCCS_LIM_4_0  VC+ VC- IOUT+ IOUT-\n.PARAM GAIN = 1\n.PARAM IPOS = 268E-3\n.PARAM INEG = -268E-3\nG1 IOUT+ IOUT- VALUE={LIMIT(GAIN*V(VC+,VC-),INEG,IPOS)}\n.ENDS\n \n\n* VOLTAGE-CONTROLLED CURRENT SOURCE (TABLE-DEFINED) - CLAW+\n.SUBCKT VCCS_LIM_CLAW+_0  VC+ VC- IOUT+ IOUT-\nG1 IOUT+ IOUT- TABLE {(V(VC+,VC-))} =\n+(0, 1E-5)\n+(10, 6.38E-4)\n+(19, 1.39E-3)\n+(20, 1.46E-3)\n+(24, 1.99E-3)\n+(25, 2.24E-3)\n+(27.4, 1.03E-2)\n.ENDS\n \n\n* VOLTAGE-CONTROLLED CURRENT SOURCE (TABLE-DEFINED) - CLAW-\n.SUBCKT VCCS_LIM_CLAW-_0  VC+ VC- IOUT+ IOUT-\nG1 IOUT+ IOUT- TABLE {(V(VC+,VC-))} =\n+(0, 1E-5)\n+(10, 5.79E-4)\n+(15, 8.97E-4)\n+(20, 1.26E-3)\n+(25, 1.74E-3)\n+(26, 3.56E-3)\n+(27.35, 6.17E-3)\n.ENDS\n \n\n* VOLTAGE-CONTROLLED CURRENT SOURCE WITH LIMITS - CLAW CLAMP\n.SUBCKT VCCS_LIM_3_0  VC+ VC- IOUT+ IOUT-\n.PARAM GAIN = 1\n.PARAM IPOS = 134E-3\n.PARAM INEG = -134E-3\nG1 IOUT+ IOUT- VALUE={LIMIT(GAIN*V(VC+,VC-),INEG,IPOS)}\n.ENDS\n \n\n* OVERLOAD SENSE FOR ZO SWITCHES\n.SUBCKT OL_SENSE_0  COM SW+ OLN  OLP\n* PINS          COM SW+ OLN OLP\nGSW+ COM SW+ VALUE = {IF((V(OLN,COM)>10E-3 | V(OLP,COM)>10E-3),1,0)}\n.ENDS\n \n\n* VOLTAGE-CONTROLLED CURRENT SOURCE WITH EXTERNAL LIMITS - VCM CLAMP\n.SUBCKT VCCS_EXT_LIM_0  VIN+ VIN- IOUT- IOUT+ VP+ VP-\n.PARAM GAIN = 1\nG1 IOUT+ IOUT- VALUE={LIMIT(GAIN*V(VIN+,VIN-),V(VP-,VIN-), V(VP+,VIN-))}\n.ENDS\n \n\n.END

The netlist it stands for:
* bandpass.asc
V1 26v 0 26V
V3 N007 0 SINE(0 4 150) AC 1
R2 N002 N005 20k
R1 N001 N007 20k
R3 N001 0 100
XU1 N009 N005 26v 0 N002 TL07XH_TL08XH  ; pins In+ In- V+ V- OUT
V2 N009 0 14V
C1 N002 N001 0.1µ
C2 N005 N001 0.1µ
V4 N008 0 SINE(0 4 150) AC 1
R4 N004 N006 200k
R5 N003 N008 100k
R6 N003 0 499
XU2 N010 N006 26v 0 N004 TL07XH_TL08XH  ; pins In+ In- V+ V- OUT
V5 N010 0 14V
C3 N004 N003 14n
C4 N006 N003 18n
* .tran 0 1 0 10u
.ac dec 1000 1 10Meg
* TL07XH_TL08XH - Rev. B
* Created by Gerasimos Madalvanos & Carolina Walter; December 29, 2020 - Revised by GPAMPS Team; 2021-08-20
* Created with Green-Williams-Lis Op Amp Macro-model Architecture
* Copyright 2020 by Texas Instruments Corporation
******************************************************
* MACRO-MODEL SIMULATED PARAMETERS:
******************************************************
* OPEN-LOOP GAIN AND PHASE VS. FREQUENCY  WITH RL, CL EFFECTS (Aol)
* UNITY GAIN BANDWIDTH (GBW)
* INPUT COMMON-MODE REJECTION RATIO VS. FREQUENCY (CMRR)
* POWER SUPPLY REJECTION RATIO VS. FREQUENCY (PSRR)
* DIFFERENTIAL INPUT IMPEDANCE (Zid)
* COMMON-MODE INPUT IMPEDANCE (Zic)
* OPEN-LOOP OUTPUT IMPEDANCE VS. FREQUENCY (Zo)
* OUTPUT CURRENT THROUGH THE SUPPLY (Iout)
* INPUT VOLTAGE NOISE DENSITY VS. FREQUENCY (en)
* INPUT CURRENT NOISE DENSITY VS. FREQUENCY (in)
* OUTPUT VOLTAGE SWING vs. OUTPUT CURRENT (Vo)
* SHORT-CIRCUIT OUTPUT CURRENT (Isc)
* QUIESCENT CURRENT (Iq)
* SETTLING TIME VS. CAPACITIVE LOAD (ts)
* SLEW RATE (SR)
* SMALL SIGNAL OVERSHOOT VS. CAPACITIVE LOAD
* LARGE SIGNAL RESPONSE
* OVERLOAD RECOVERY TIME (tor)
* INPUT BIAS CURRENT (Ib)
* INPUT OFFSET CURRENT (Ios)
* INPUT OFFSET VOLTAGE (Vos)
* INPUT COMMON-MODE VOLTAGE RANGE (Vcm)
* INPUT OFFSET VOLTAGE VS. INPUT COMMON-MODE VOLTAGE (Vos vs. Vcm)
* INPUT/OUTPUT ESD CELLS (ESDin, ESDout)
******************************************************
.subckt TL07XH_TL08XH IN+ IN- VCC VEE OUT
******************************************************
V_GRp       35 MID 67
V_GRn       36 MID -67
I_OS        ESDn MID 500F
I_B         45 MID 1P
V_ISCp      63 MID 25
V_ISCn      64 MID -25
V_ORn       53 VCLP -6
V11         68 52 0
V_ORp       51 VCLP 6
V12         67 50 0
V4          60 OUT 0
VCM_MIN     84 VEE_B 1
VCM_MAX     85 VCC_B 300M
I_Q         VCC VEE 937.5U
R16         21 MID R_RES_1 1K
C5          22 21 50F
R15         21 22 R_RES_2 10K
R14         22 MID R_RES_3 1
GVCCS2      22 MID 23 MID  -11.1
C4          24 MID 1.2P
R11         23 24 R_RES_4 10K
R6          23 25 R_RES_5 3K
R5          25 MID R_RES_6 1
GVCCS1      25 MID 26 MID  -2.4
G2          28 29 27 MID  -1M
R8          29 28 R_RES_7 1K
R129        MID 30 R_RES_8 1
G4          30 MID ESDp MID  -6.56M
R1a1        30 27 R_RES_9 100MEG
C1a1        27 30 1.11P
R2a1        MID 27 R_RES_10 14.05K
R13         26 MID R_RES_11 50K
C1          31 26 13P
R12         26 31 R_RES_12 10K
G18         32 MID VSENSE MID  -1U
C1a         32 MID 12.64F
R117        32 MID R_RES_13 1MEG
C3          33 MID 3F
R120        MID 33 R_RES_14 1MEG
G46         33 MID 34 MID  -1U
XGR_AMP     35 36 37 MID 38 39 CLAMP_AMP_HI_0
R49         35 MID R_RES_15 1G
R54         36 MID R_RES_16 1G
R55         VSENSE 37 R_RES_17 1M
C16         37 MID 1F
R50         38 MID R_RES_18 1
R53         MID 39 R_RES_19 1
R51         38 40 R_RES_20 1M
R52         39 41 R_RES_21 1M
C14         40 MID 1F
C15         MID 41 1F
XGR_SRC     40 41 CLAMP MID VCCS_LIM_GR_0
Xi_nn       ESDn MID FEMT_0
R2b2        MID 42 R_RES_22 63.31K
C1b2        42 43 239.6F
R1b2        43 42 R_RES_23 100MEG
R131        MID 43 R_RES_24 1
G55         43 MID VCC_B MID  -538.2M
XVOS_VS_VCM 29 44 VCC VEE VOS_SRC_0
C2          34 MID 5.2F
R123        MID 34 R_RES_25 1MEG
G44         34 MID 32 MID  -1U
XVOS_DRIFT  44 45 VOS_DRIFT_0
S5          VEE ESDp VEE ESDp  S_VSWITCH_1
S4          VEE ESDn VEE ESDn  S_VSWITCH_2
S2          ESDn VCC ESDn VCC  S_VSWITCH_3
S3          ESDp VCC ESDp VCC  S_VSWITCH_4
C18         46 MID 1P
R57         47 46 R_RES_26 100
C17         48 MID 1P
R56         49 48 R_RES_27 100
R48         MID 50 R_RES_28 1
G11         50 MID 51 MID  -1
R47         52 MID R_RES_29 1
G10         52 MID 53 MID  -1
R116        54 MID R_RES_30 1
XZO_SRC     21 MID MID 54 VCCS_LIM_ZO_0
Xi_np       MID 45 FEMT_1
Xe_n        ESDp 45 VNSE_0
C20         CLAMP MID 240N
R61         MID CLAMP R_RES_31 1MEG
XAOL_2      55 MID MID CLAMP VCCS_LIM_2_0
R60         MID 55 R_RES_32 1MEG
XAOL_1      56 57 MID 55 VCCS_LIM_1_0
R114        31 MID R_RES_33 1
G7          31 MID 58 MID  -2.15
C1a4        59 58 75N
R2a5        58 MID R_RES_34 1.2K
R1a5        58 59 R_RES_35 10K
Rdummy      MID 60 R_RES_36 10.5K
Rx          60 54 R_RES_37 105K
R7          59 MID R_RES_38 1
G40         59 MID CL_CLAMP 60  -89
R2a6        MID 61 R_RES_39 63.31K
C1a5        61 62 239.6F
R1a6        62 61 R_RES_40 100MEG
G57         62 MID VEE_B MID  -538.2M
R133        MID 62 R_RES_41 1
XIQp        VIMON MID MID VCC VCCS_LIMIT_IQ_0
XIQn        MID VIMON VEE MID VCCS_LIMIT_IQ_0
C_DIFF      ESDp ESDn 1.75P
XCL_AMP     63 64 VIMON MID 65 66 CLAMP_AMP_LO_0
SOR_SWp     CLAMP 67 CLAMP 67  S_VSWITCH_5
SOR_SWn     68 CLAMP 68 CLAMP  S_VSWITCH_6
R42         65 MID R_RES_42 1
R45         MID 66 R_RES_43 1
R43         65 69 R_RES_44 1M
R44         66 70 R_RES_45 1M
C12         69 MID 1F
C13         MID 70 1F
XCL_SRC     69 70 CL_CLAMP MID VCCS_LIM_4_0
R41         63 MID R_RES_46 1G
R46         MID 64 R_RES_47 1G
XCLAWp      VIMON MID 71 VCC_B VCCS_LIM_CLAW+_0
XCLAWn      MID VIMON VEE_B 72 VCCS_LIM_CLAW-_0
R29         71 VCC_B R_RES_48 1K
R30         71 73 R_RES_49 1M
R32         VEE_B 72 R_RES_50 1K
R33         74 72 R_RES_51 1M
C9          74 MID 1F
C8          MID 73 1F
G8          VCC_CLP MID 73 MID  -1M
R31         VCC_CLP MID R_RES_52 1K
G9          VEE_CLP MID 74 MID  -1M
R34         MID VEE_CLP R_RES_53 1K
XCLAW_AMP   VCC_CLP VEE_CLP VOUT_S MID 75 76 CLAMP_AMP_LO_0
R35         VCC_CLP MID R_RES_54 1G
R40         VEE_CLP MID R_RES_55 1G
R36         75 MID R_RES_56 1
R39         MID 76 R_RES_57 1
R37         75 77 R_RES_58 1M
R38         76 78 R_RES_59 1M
C10         77 MID 1F
C11         MID 78 1F
XCLAW_SRC   77 78 CLAW_CLAMP MID VCCS_LIM_3_0
H2          49 MID V11 -1
H3          47 MID V12 1
C19         SW_OL MID 1P
R59         79 SW_OL R_RES_60 100
R58         79 MID R_RES_61 1
XOL_SENSE   MID 79 48 46 OL_SENSE_0
S1          59 58 SW_OL MID  S_VSWITCH_7
H3_2        80 MID V4 1K
S7          VEE OUT VEE OUT  S_VSWITCH_8
S6          OUT VCC OUT VCC  S_VSWITCH_9
R83         MID 81 R_RES_62 1G
R_VOUT_S    81 VOUT_S R_RES_63 100
C_VOUT_S    VOUT_S MID 1N
E3          81 MID OUT MID  1
C_VIMON     VIMON MID 1N
R_VIMON     80 VIMON R_RES_64 100
R81         MID 80 R_RES_65 1G
R_VCLP      82 VCLP R_RES_66 100
C_VCLP      VCLP MID 100P
E2          82 MID CL_CLAMP MID  1
R66         MID CL_CLAMP R_RES_67 1K
G16         CL_CLAMP MID CLAW_CLAMP MID  -1M
R65         MID CLAW_CLAMP R_RES_68 1K
G15         CLAW_CLAMP MID 33 MID  -1M
R62         MID VSENSE R_RES_69 1K
G12         VSENSE MID CLAMP MID  -1M
C7          56 MID 1F
R28         56 83 R_RES_70 1M
R25         MID 84 R_RES_71 1G
R26         85 MID R_RES_72 1G
R27         MID 83 R_RES_73 1
XVCM_CLAMP  86 MID 83 MID 85 84 VCCS_EXT_LIM_0
E6          MID 0 87 0  1
R109        VEE_B 0 R_RES_74 1
R113        88 VEE_B R_RES_75 1M
C35         88 0 1F
R112        87 88 R_RES_76 1MEG
C34         87 0 100e-9
R108        87 0 R_RES_77 1T
R111        89 87 R_RES_78 1MEG
C33         89 0 1F
R110        VCC_B 89 R_RES_79 1M
R107        VCC_B 0 R_RES_80 1
G37         VEE_B 0 VEE 0  -1
G36         VCC_B 0 VCC 0  -1
R21         90 86 R_RES_81 1K
G6          86 90 42 61  -1M
R10         57 ESDn R_RES_82 1M
R9          90 28 R_RES_83 1M
C_CMn       ESDn MID 1.25P
C_CMp       MID ESDp 1.25P
R4          ESDn MID R_RES_84 1T
R3          MID ESDp R_RES_85 1T
R2          IN- ESDn R_RES_86 10M
R1          IN+ ESDp R_RES_87 10M
.MODEL R_RES_1 RES ( TCE=0 T_ABS=-273.15)
.MODEL R_RES_2 RES ( TCE=0 T_ABS=-273.15)
.MODEL R_RES_3 RES ( TCE=0 T_ABS=-273.15)
.MODEL R_RES_4 RES ( TCE=0 T_ABS=-273.15)
.MODEL R_RES_5 RES ( TCE=0 T_ABS=-273.15)
.MODEL R_RES_6 RES ( TCE=0 T_ABS=-273.15)
.MODEL R_RES_7 RES ( TCE=0 T_ABS=-273.15)
.MODEL R_RES_8 RES ( TCE=0 T_ABS=-273.15)
.MODEL R_RES_9 RES ( TCE=0 T_ABS=-273.15)
.MODEL R_RES_10 RES ( TCE=0 T_ABS=-273.15)
.MODEL R_RES_11 RES ( TCE=0 T_ABS=-273.15)
.MODEL R_RES_12 RES ( TCE=0 T_ABS=-273.15)
.MODEL R_RES_13 RES ( TCE=0 T_ABS=-273.15)
.MODEL R_RES_14 RES ( TCE=0 T_ABS=-273.15)
.MODEL R_RES_15 RES ( TCE=0 T_ABS=-273.15)
.MODEL R_RES_16 RES ( TCE=0 T_ABS=-273.15)
.MODEL R_RES_17 RES ( TCE=0 T_ABS=-273.15)
.MODEL R_RES_18 RES ( TCE=0 T_ABS=-273.15)
.MODEL R_RES_19 RES ( TCE=0 T_ABS=-273.15)
.MODEL R_RES_20 RES ( TCE=0 T_ABS=-273.15)
.MODEL R_RES_21 RES ( TCE=0 T_ABS=-273.15)
.MODEL R_RES_22 RES ( TCE=0 T_ABS=-273.15)
.MODEL R_RES_23 RES ( TCE=0 T_ABS=-273.15)
.MODEL R_RES_24 RES ( TCE=0 T_ABS=-273.15)
.MODEL R_RES_25 RES ( TCE=0 T_ABS=-273.15)
.MODEL S_VSWITCH_1 VSWITCH (RON=100 ROFF=1T VON=1 VOFF=100M)
.MODEL S_VSWITCH_2 VSWITCH (RON=100 ROFF=1T VON=1 VOFF=100M)
.MODEL S_VSWITCH_3 VSWITCH (RON=50 ROFF=1T VON=500M VOFF=100M)
.MODEL S_VSWITCH_4 VSWITCH (RON=50 ROFF=1T VON=500M VOFF=100M)
.MODEL R_RES_26 RES ( TCE=0 T_ABS=-273.15)
.MODEL R_RES_27 RES ( TCE=0 T_ABS=-273.15)
.MODEL R_RES_28 RES ( TCE=0 T_ABS=-273.15)
.MODEL R_RES_29 RES ( TCE=0 T_ABS=-273.15)
.MODEL R_RES_30 RES ( TCE=0 T_ABS=-273.15)
.MODEL R_RES_31 RES ( TCE=0 T_ABS=-273.15)
.MODEL R_RES_32 RES ( TCE=0 T_ABS=-273.15)
.MODEL R_RES_33 RES ( TCE=0 T_ABS=-273.15)
.MODEL R_RES_34 RES ( TCE=0 T_ABS=-273.15)
.MODEL R_RES_35 RES ( TCE=0 T_ABS=-273.15)
.MODEL R_RES_36 RES ( TCE=0 T_ABS=-273.15)
.MODEL R_RES_37 RES ( TCE=0 T_ABS=-273.15)
.MODEL R_RES_38 RES ( TCE=0 T_ABS=-273.15)
.MODEL R_RES_39 RES ( TCE=0 T_ABS=-273.15)
.MODEL R_RES_40 RES ( TCE=0 T_ABS=-273.15)
.MODEL R_RES_41 RES ( TCE=0 T_ABS=-273.15)
.MODEL S_VSWITCH_5 VSWITCH (RON=10M ROFF=1G VON=10M VOFF=0)
.MODEL S_VSWITCH_6 VSWITCH (RON=10M ROFF=1G VON=10M VOFF=0)
.MODEL R_RES_42 RES ( TCE=0 T_ABS=-273.15)
.MODEL R_RES_43 RES ( TCE=0 T_ABS=-273.15)
.MODEL R_RES_44 RES ( TCE=0 T_ABS=-273.15)
.MODEL R_RES_45 RES ( TCE=0 T_ABS=-273.15)
.MODEL R_RES_46 RES ( TCE=0 T_ABS=-273.15)
.MODEL R_RES_47 RES ( TCE=0 T_ABS=-273.15)
.MODEL R_RES_48 RES ( TCE=0 T_ABS=-273.15)
.MODEL R_RES_49 RES ( TCE=0 T_ABS=-273.15)
.MODEL R_RES_50 RES ( TCE=0 T_ABS=-273.15)
.MODEL R_RES_51 RES ( TCE=0 T_ABS=-273.15)
.MODEL R_RES_52 RES ( TCE=0 T_ABS=-273.15)
.MODEL R_RES_53 RES ( TCE=0 T_ABS=-273.15)
.MODEL R_RES_54 RES ( TCE=0 T_ABS=-273.15)
.MODEL R_RES_55 RES ( TCE=0 T_ABS=-273.15)
.MODEL R_RES_56 RES ( TCE=0 T_ABS=-273.15)
.MODEL R_RES_57 RES ( TCE=0 T_ABS=-273.15)
.MODEL R_RES_58 RES ( TCE=0 T_ABS=-273.15)
.MODEL R_RES_59 RES ( TCE=0 T_ABS=-273.15)
.MODEL R_RES_60 RES ( TCE=0 T_ABS=-273.15)
.MODEL R_RES_61 RES ( TCE=0 T_ABS=-273.15)
.MODEL S_VSWITCH_7 VSWITCH (RON=1M ROFF=1G VON=900M VOFF=800M)
.MODEL S_VSWITCH_8 VSWITCH (RON=50 ROFF=1T VON=500M VOFF=450M)
.MODEL S_VSWITCH_9 VSWITCH (RON=50 ROFF=1T VON=500M VOFF=450M)
.MODEL R_RES_62 RES ( TCE=0 T_ABS=-273.15)
.MODEL R_RES_63 RES ( TCE=0 T_ABS=-273.15)
.MODEL R_RES_64 RES ( TCE=0 T_ABS=-273.15)
.MODEL R_RES_65 RES ( TCE=0 T_ABS=-273.15)
.MODEL R_RES_66 RES ( TCE=0 T_ABS=-273.15)
.MODEL R_RES_67 RES ( TCE=0 T_ABS=-273.15)
.MODEL R_RES_68 RES ( TCE=0 T_ABS=-273.15)
.MODEL R_RES_69 RES ( TCE=0 T_ABS=-273.15)
.MODEL R_RES_70 RES ( TCE=0 T_ABS=-273.15)
.MODEL R_RES_71 RES ( TCE=0 T_ABS=-273.15)
.MODEL R_RES_72 RES ( TCE=0 T_ABS=-273.15)
.MODEL R_RES_73 RES ( TCE=0 T_ABS=-273.15)
.MODEL R_RES_74 RES ( TCE=0 T_ABS=-273.15)
.MODEL R_RES_75 RES ( TCE=0 T_ABS=-273.15)
.MODEL R_RES_76 RES ( TCE=0 T_ABS=-273.15)
.MODEL R_RES_77 RES ( TCE=0 T_ABS=-273.15)
.MODEL R_RES_78 RES ( TCE=0 T_ABS=-273.15)
.MODEL R_RES_79 RES ( TCE=0 T_ABS=-273.15)
.MODEL R_RES_80 RES ( TCE=0 T_ABS=-273.15)
.MODEL R_RES_81 RES ( TCE=0 T_ABS=-273.15)
.MODEL R_RES_82 RES ( TCE=0 T_ABS=-273.15)
.MODEL R_RES_83 RES ( TCE=0 T_ABS=-273.15)
.MODEL R_RES_84 RES ( TCE=0 T_ABS=-273.15)
.MODEL R_RES_85 RES ( TCE=0 T_ABS=-273.15)
.MODEL R_RES_86 RES ( TCE=0 T_ABS=-273.15)
.MODEL R_RES_87 RES ( TCE=0 T_ABS=-273.15)
.ends TL07XH_TL08XH
* CLAMP AMP - OVERLOAD AND GROSS CLAMP
.SUBCKT CLAMP_AMP_HI_0  VC+ VC- VIN COM VO+ VO-
*  PINS     CLAMP V+  CLAMP V-  VIN  COM   VOUT+  VOUT-
.PARAM G=10
* OUTPUT G(COM,0) WHEN CONDITION NOT MET
GVO+ COM VO+ VALUE = {IF(V(VIN,COM)>V(VC+,COM),((V(VIN,COM)-V(VC+,COM))*G),0)}
GVO- COM VO- VALUE = {IF(V(VIN,COM)<V(VC-,COM),((V(VC-,COM)-V(VIN,COM))*G),0)}
.ENDS
* VOLTAGE-CONTROLLED CURRENT SOURCE WITH LIMITS - GROSS CLAMP
.SUBCKT VCCS_LIM_GR_0  VC+ VC- IOUT+ IOUT-
.PARAM GAIN = 1
.PARAM IPOS = 10
.PARAM INEG = -10
G1 IOUT+ IOUT- VALUE={LIMIT(GAIN*V(VC+,VC-),INEG,IPOS)}
.ENDS
* FEMT - INPUT CURRENT NOISE IN FA/RT-HZ
.SUBCKT FEMT_0  1 2
.PARAM NVRF=80
.PARAM RNVF={1.184*PWR(NVRF,2)}
E1 3 0 5 0 10
R1 5 0 {RNVF}
R2 5 0 {RNVF}
G1 1 2 3 0 1E-6
.ENDS
* VOLTAGE SOURCE (TABLE-DEFINED) - VOS
.SUBCKT VOS_SRC_0  V+ V- REF+ REF-
E1 V+ 1 TABLE {(V(REF+, V-))} =
+(1.6, 125E-6)
+(2.1, 25E-6)
+(3, 15E-6)
+(4, 15E-6)
+(4.3, 0)
E2 1 V- TABLE {(V(V-, REF-))}=
+(-0.1, -35E-6)
+(0, -10E-6)
+(0.1, 0)
.ENDS
* INPUT OFFSET VOLTAGE VS. TEMPERATURE
.SUBCKT VOS_DRIFT_0  VOS+ VOS-
.PARAM DC = -0.0126
.PARAM POL = 1
.PARAM DRIFT = 0
E1 VOS+ VOS- VALUE={DC+POL*DRIFT*(TEMP-27)}
.ENDS
* VOLTAGE-CONTROLLED CURRENT SOURCE WITH LIMITS - ZO OUTPUT
.SUBCKT VCCS_LIM_ZO_0  VC+ VC- IOUT+ IOUT-
.PARAM GAIN = 2
.PARAM IPOS = 5250
.PARAM INEG = -5250
G1 IOUT+ IOUT- VALUE={LIMIT(GAIN*V(VC+,VC-),INEG,IPOS)}
.ENDS
* FEMT - INPUT CURRENT NOISE IN FA/RT-HZ
.SUBCKT FEMT_1  1 2
.PARAM NVRF= 80
.PARAM RNVF={1.184*PWR(NVRF,2)}
E1 3 0 5 0 10
R1 5 0 {RNVF}
R2 5 0 {RNVF}
G1 1 2 3 0 1E-6
.ENDS
* VNSE - INPUT VOLTAGE NOISE IN NV/RT-HZ
.SUBCKT VNSE_0  1 2
.PARAM FLW=1
.PARAM NLF=1.02E3
.PARAM NVR=1.98E1
.PARAM GLF={PWR(FLW,0.25)*NLF/1164}
.PARAM RNV={1.184*PWR(NVR,2)}
.MODEL DVN D KF={PWR(FLW,0.5)/1E11} IS=1.0E-16
I1 0 7 10E-3
I2 0 8 10E-3
D1 7 0 DVN
D2 8 0 DVN
E1 3 6 7 8 {GLF}
R1 3 0 1E9
R2 3 0 1E9
R3 3 6 1E9
E2 6 4 5 0 10
R4 5 0 {RNV}
R5 5 0 {RNV}
R6 3 4 1E9
R7 4 0 1E9
E3 1 2 3 4 1
.ENDS
* VOLTAGE-CONTROLLED CURRENT SOURCE WITH LIMITS - AOL SECOND STAGE
.SUBCKT VCCS_LIM_2_0  VC+ VC- IOUT+ IOUT-
.PARAM GAIN = 11.3E-2
.PARAM IPOS = 4.8
.PARAM INEG = -4.8
G1 IOUT+ IOUT- VALUE={LIMIT(GAIN*V(VC+,VC-),INEG,IPOS)}
.ENDS
* VOLTAGE-CONTROLLED CURRENT SOURCE WITH LIMITS - AOL FIRST STAGE
.SUBCKT VCCS_LIM_1_0  VC+ VC- IOUT+ IOUT-
.PARAM GAIN = 1E-4
.PARAM IPOS = .5
.PARAM INEG = -.5
G1 IOUT+ IOUT- VALUE={LIMIT(GAIN*V(VC+,VC-),INEG,IPOS)}
.ENDS
* VOLTAGE-CONTROLLED SOURCE WITH LIMITS - IOUT DRAW
.SUBCKT VCCS_LIMIT_IQ_0  VC+ VC- IOUT+ IOUT-
.PARAM GAIN = 1E-3
G1 IOUT- IOUT+ VALUE={IF( (V(VC+,VC-)<=0),0,GAIN*V(VC+,VC-) )}
.ENDS
* CLAMP AMP - CLAW AND CURRENT LIMIT CLAMP
.SUBCKT CLAMP_AMP_LO_0  VC+ VC- VIN COM VO+ VO-
*  PINS     CLAMP V+  CLAMP V-  VIN  COM   VOUT+  VOUT-
.PARAM G=1
* OUTPUT G(COM,0) WHEN CONDITION NOT MET
GVO+ COM VO+ VALUE = {IF(V(VIN,COM)>V(VC+,COM),((V(VIN,COM)-V(VC+,COM))*G),0)}
GVO- COM VO- VALUE = {IF(V(VIN,COM)<V(VC-,COM),((V(VC-,COM)-V(VIN,COM))*G),0)}
.ENDS
* VOLTAGE-CONTROLLED CURRENT SOURCE WITH LIMITS - CURRENT LIMIT CLAMP
.SUBCKT VCCS_LIM_4_0  VC+ VC- IOUT+ IOUT-
.PARAM GAIN = 1
.PARAM IPOS = 268E-3
.PARAM INEG = -268E-3
G1 IOUT+ IOUT- VALUE={LIMIT(GAIN*V(VC+,VC-),INEG,IPOS)}
.ENDS
* VOLTAGE-CONTROLLED CURRENT SOURCE (TABLE-DEFINED) - CLAW+
.SUBCKT VCCS_LIM_CLAW+_0  VC+ VC- IOUT+ IOUT-
G1 IOUT+ IOUT- TABLE {(V(VC+,VC-))} =
+(0, 1E-5)
+(10, 6.38E-4)
+(19, 1.39E-3)
+(20, 1.46E-3)
+(24, 1.99E-3)
+(25, 2.24E-3)
+(27.4, 1.03E-2)
.ENDS
* VOLTAGE-CONTROLLED CURRENT SOURCE (TABLE-DEFINED) - CLAW-
.SUBCKT VCCS_LIM_CLAW-_0  VC+ VC- IOUT+ IOUT-
G1 IOUT+ IOUT- TABLE {(V(VC+,VC-))} =
+(0, 1E-5)
+(10, 5.79E-4)
+(15, 8.97E-4)
+(20, 1.26E-3)
+(25, 1.74E-3)
+(26, 3.56E-3)
+(27.35, 6.17E-3)
.ENDS
* VOLTAGE-CONTROLLED CURRENT SOURCE WITH LIMITS - CLAW CLAMP
.SUBCKT VCCS_LIM_3_0  VC+ VC- IOUT+ IOUT-
.PARAM GAIN = 1
.PARAM IPOS = 134E-3
.PARAM INEG = -134E-3
G1 IOUT+ IOUT- VALUE={LIMIT(GAIN*V(VC+,VC-),INEG,IPOS)}
.ENDS
* OVERLOAD SENSE FOR ZO SWITCHES
.SUBCKT OL_SENSE_0  COM SW+ OLN  OLP
* PINS          COM SW+ OLN OLP
GSW+ COM SW+ VALUE = {IF((V(OLN,COM)>10E-3 | V(OLP,COM)>10E-3),1,0)}
.ENDS
* VOLTAGE-CONTROLLED CURRENT SOURCE WITH EXTERNAL LIMITS - VCM CLAMP
.SUBCKT VCCS_EXT_LIM_0  VIN+ VIN- IOUT- IOUT+ VP+ VP-
.PARAM GAIN = 1
G1 IOUT+ IOUT- VALUE={LIMIT(GAIN*V(VIN+,VIN-),V(VP-,VIN-), V(VP+,VIN-))}
.ENDS
.END
.backanno
.end

* Results of the author's LTspice run, read from the files saved beside the schematic
* Operating Point, zero values left out:
*   V(26v) = 26 V
*   V(n002) = 14 V
*   V(n005) = 14 V
*   V(n009) = 14 V
*   V(n004) = 14 V
*   V(n006) = 14 V
*   V(n010) = 14 V
*   I(R2) = 5.576 pA
*   I(R4) = 5.455 pA
*   I(V1) = -1.875 mA
*   I(V2) = -5.23 pA
*   I(V5) = -5.23 pA
*   Ix(u1:IN+) = 5.329 pA
*   Ix(u1:IN-) = 5.507 pA
*   Ix(u1:VCC) = 937.5 µA
*   Ix(u1:VEE) = -937.5 µA
*   Ix(u1:OUT) = -5.576 pA
*   Ix(u2:IN+) = 5.329 pA
*   Ix(u2:IN-) = 5.329 pA
*   Ix(u2:VCC) = 937.5 µA
*   Ix(u2:VEE) = -937.5 µA
*   Ix(u2:OUT) = -5.455 pA
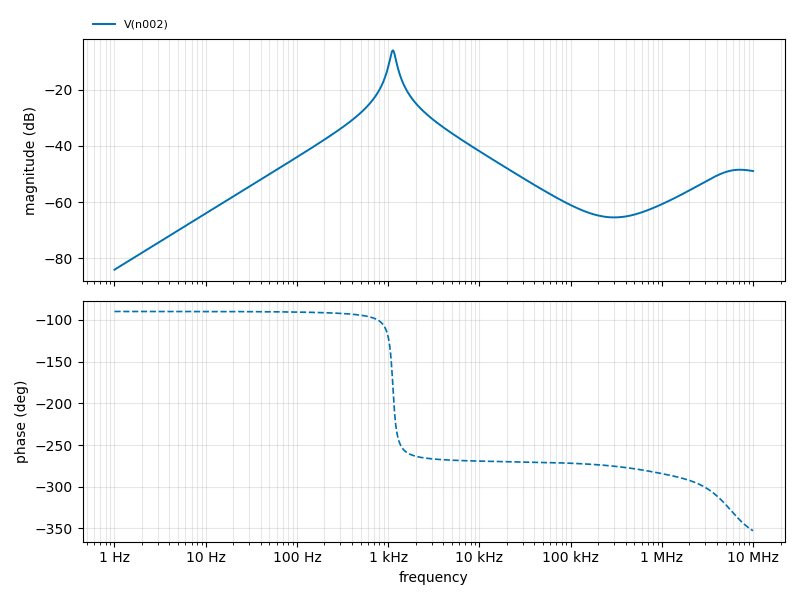
[diagram p4: AC Analysis of bandpass.asc, plotted from the saved traces]
* AC Analysis, 1 run:
*   V(n002): -84.08 dB at 1 Hz, -48.95 dB at 10 MHz, peak -6.01 dB at 1.127 kHz, 3 dB below the peak at 1.05 kHz and 1.209 kHz